# Altium schematic sheet tie-il0.SchDoc: Net Tie IL0
size 368 x 254 mm; CheckedBy: J. Brinton; CompanyName: Signal Laboratories, Inc.; DrawnBy: J. Brinton; Engineer: J. Brinton; Address1: 3479 Edison Way; Address2: Menlo Park CA 94025; Address3: +1 (877) 778-8435; Address4: siglabs.com; Revision: 3; SheetNumber: 41; SheetTotal: 45
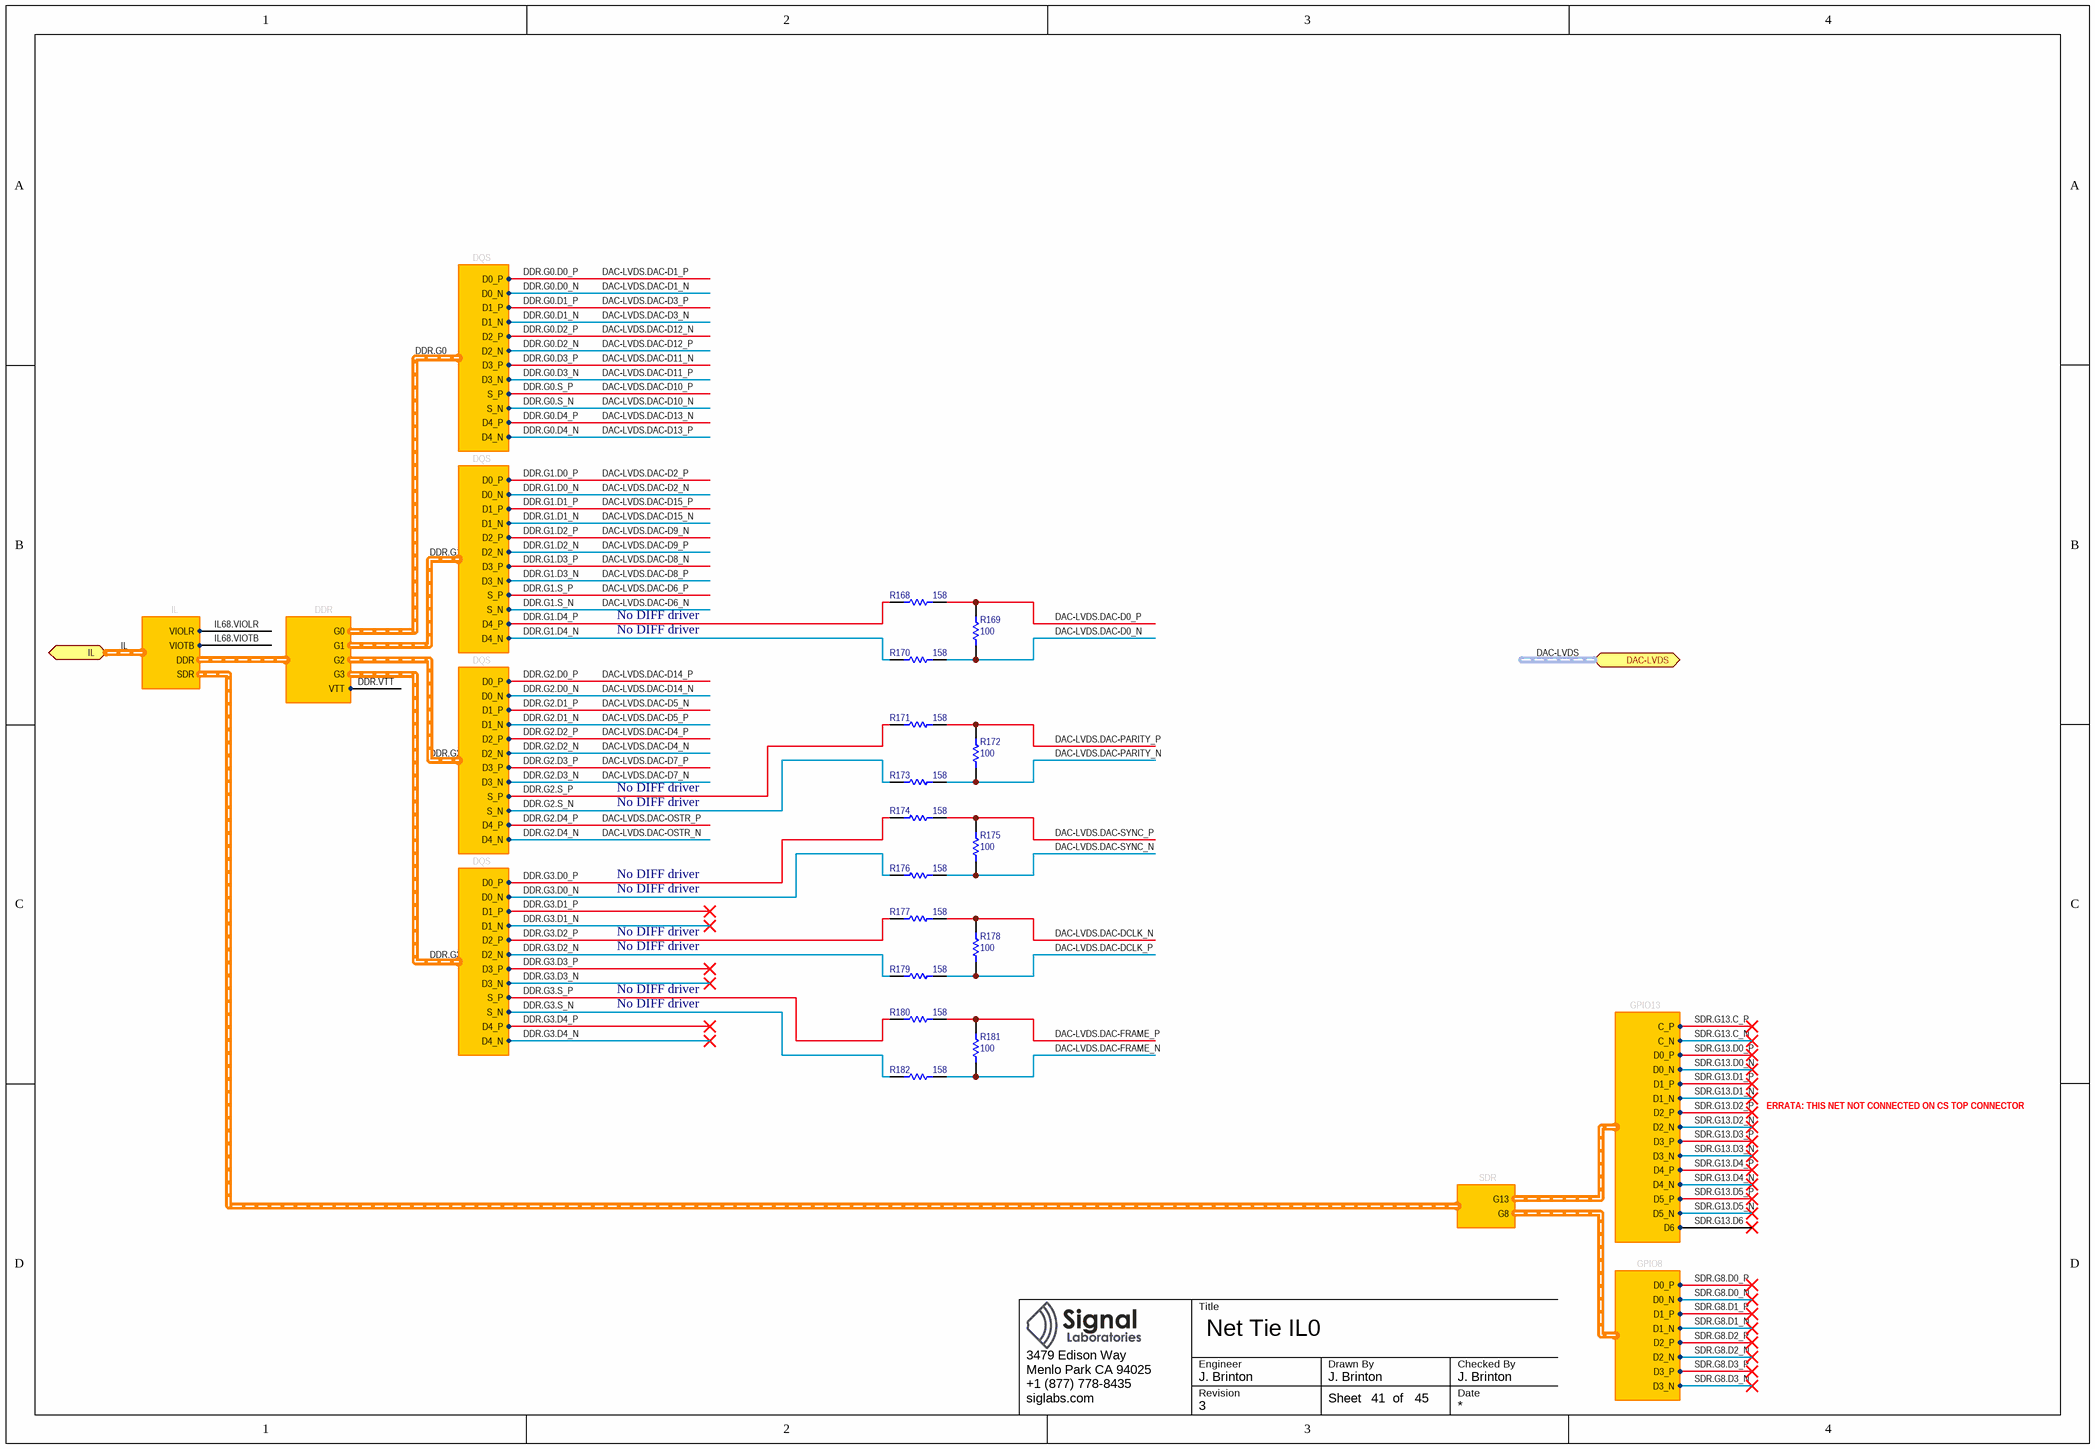
[diagram p0: tie-il0.SchDoc]

## Parts
R168  value 158  [RESC1005X40N]  (hidden comment: ERJ-2RKF1580X)
R169  value 100  [RESC1005X40N]  (hidden comment: ERJ-PA2F1000X)
R170  value 158  [RESC1005X40N]  (hidden comment: ERJ-2RKF1580X)
R171  value 158  [RESC1005X40N]  (hidden comment: ERJ-2RKF1580X)
R172  value 100  [RESC1005X40N]  (hidden comment: ERJ-PA2F1000X)
R173  value 158  [RESC1005X40N]  (hidden comment: ERJ-2RKF1580X)
R174  value 158  [RESC1005X40N]  (hidden comment: ERJ-2RKF1580X)
R175  value 100  [RESC1005X40N]  (hidden comment: ERJ-PA2F1000X)
R176  value 158  [RESC1005X40N]  (hidden comment: ERJ-2RKF1580X)
R177  value 158  [RESC1005X40N]  (hidden comment: ERJ-2RKF1580X)
R178  value 100  [RESC1005X40N]  (hidden comment: ERJ-PA2F1000X)
R179  value 158  [RESC1005X40N]  (hidden comment: ERJ-2RKF1580X)
R180  value 158  [RESC1005X40N]  (hidden comment: ERJ-2RKF1580X)
R181  value 100  [RESC1005X40N]  (hidden comment: ERJ-PA2F1000X)
R182  value 158  [RESC1005X40N]  (hidden comment: ERJ-2RKF1580X)

## Ports
DAC-LVDS (harness DAC-LVDS), IL (harness IL)

## Harnesses
DQS: D0_P, D0_N, D1_P, D1_N, D2_P, D2_N, D3_P, D3_N, D4_P, D4_N, S_P, S_N
DDR: G0, G1, G2, G3, VTT
GPIO8: D0_P, D0_N, D1_P, D1_N, D2_P, D2_N, D3_P, D3_N
SDR: G13, G8
GPIO13: C_P, C_N, D0_P, D0_N, D1_P, D1_N, D2_P, D2_N, D3_P, D3_N, D4_P, D4_N, D5_P, D5_N, D6
IL: DDR, SDR, VIOLR, VIOTB

## Nets
DAC-LVDS.DAC-D0_N: R169.2 R170.1
DAC-LVDS.DAC-D0_P: R168.1 R169.1
DAC-LVDS.DAC-D1_N: harness DQS.D0_N  [also labelled DDR.G0.D0_N]
DAC-LVDS.DAC-D1_P: harness DQS.D0_P  [also labelled DDR.G0.D0_P]
DAC-LVDS.DAC-D2_N: harness DQS.D0_N  [also labelled DDR.G1.D0_N]
DAC-LVDS.DAC-D2_P: harness DQS.D0_P  [also labelled DDR.G1.D0_P]
DAC-LVDS.DAC-D3_N: harness DQS.D1_N  [also labelled DDR.G0.D1_N]
DAC-LVDS.DAC-D3_P: harness DQS.D1_P  [also labelled DDR.G0.D1_P]
DAC-LVDS.DAC-D4_N: harness DQS.D2_N  [also labelled DDR.G2.D2_N]
DAC-LVDS.DAC-D4_P: harness DQS.D2_P  [also labelled DDR.G2.D2_P]
DAC-LVDS.DAC-D5_N: harness DQS.D1_P  [also labelled DDR.G2.D1_P]
DAC-LVDS.DAC-D5_P: harness DQS.D1_N  [also labelled DDR.G2.D1_N]
DAC-LVDS.DAC-D6_N: harness DQS.S_N  [also labelled DDR.G1.S_N]
DAC-LVDS.DAC-D6_P: harness DQS.S_P  [also labelled DDR.G1.S_P]
DAC-LVDS.DAC-D7_N: harness DQS.D3_N  [also labelled DDR.G2.D3_N]
DAC-LVDS.DAC-D7_P: harness DQS.D3_P  [also labelled DDR.G2.D3_P]
DAC-LVDS.DAC-D8_N: harness DQS.D3_P  [also labelled DDR.G1.D3_P]
DAC-LVDS.DAC-D8_P: harness DQS.D3_N  [also labelled DDR.G1.D3_N]
DAC-LVDS.DAC-D9_N: harness DQS.D2_P  [also labelled DDR.G1.D2_P]
DAC-LVDS.DAC-D9_P: harness DQS.D2_N  [also labelled DDR.G1.D2_N]
DAC-LVDS.DAC-D10_N: harness DQS.S_N  [also labelled DDR.G0.S_N]
DAC-LVDS.DAC-D10_P: harness DQS.S_P  [also labelled DDR.G0.S_P]
DAC-LVDS.DAC-D11_N: harness DQS.D3_P  [also labelled DDR.G0.D3_P]
DAC-LVDS.DAC-D11_P: harness DQS.D3_N  [also labelled DDR.G0.D3_N]
DAC-LVDS.DAC-D12_N: harness DQS.D2_P  [also labelled DDR.G0.D2_P]
DAC-LVDS.DAC-D12_P: harness DQS.D2_N  [also labelled DDR.G0.D2_N]
DAC-LVDS.DAC-D13_N: harness DQS.D4_P  [also labelled DDR.G0.D4_P]
DAC-LVDS.DAC-D13_P: harness DQS.D4_N  [also labelled DDR.G0.D4_N]
DAC-LVDS.DAC-D14_N: harness DQS.D0_N  [also labelled DDR.G2.D0_N]
DAC-LVDS.DAC-D14_P: harness DQS.D0_P  [also labelled DDR.G2.D0_P]
DAC-LVDS.DAC-D15_N: harness DQS.D1_N  [also labelled DDR.G1.D1_N]
DAC-LVDS.DAC-D15_P: harness DQS.D1_P  [also labelled DDR.G1.D1_P]
DAC-LVDS.DAC-DCLK_N: R177.1 R178.1
DAC-LVDS.DAC-DCLK_P: R178.2 R179.1
DAC-LVDS.DAC-FRAME_N: R181.2 R182.1
DAC-LVDS.DAC-FRAME_P: R180.1 R181.1
DAC-LVDS.DAC-OSTR_N: harness DQS.D4_N  [also labelled DDR.G2.D4_N]
DAC-LVDS.DAC-OSTR_P: harness DQS.D4_P  [also labelled DDR.G2.D4_P]
DAC-LVDS.DAC-PARITY_N: R172.2 R173.1
DAC-LVDS.DAC-PARITY_P: R171.1 R172.1
DAC-LVDS.DAC-SYNC_N: R175.2 R176.1
DAC-LVDS.DAC-SYNC_P: R174.1 R175.1
DDR.G1.D4_N: R170.2 ; harness DQS.D4_N
DDR.G1.D4_P: R168.2 ; harness DQS.D4_P
DDR.G2.S_N: R173.2 ; harness DQS.S_N
DDR.G2.S_P: R171.2 ; harness DQS.S_P
DDR.G3.D0_N: R176.2 ; harness DQS.D0_N
DDR.G3.D0_P: R174.2 ; harness DQS.D0_P
DDR.G3.D1_N: harness DQS.D1_N
DDR.G3.D1_P: harness DQS.D1_P
DDR.G3.D2_N: R179.2 ; harness DQS.D2_N
DDR.G3.D2_P: R177.2 ; harness DQS.D2_P
DDR.G3.D3_N: harness DQS.D3_N
DDR.G3.D3_P: harness DQS.D3_P
DDR.G3.D4_N: harness DQS.D4_N
DDR.G3.D4_P: harness DQS.D4_P
DDR.G3.S_N: R182.2 ; harness DQS.S_N
DDR.G3.S_P: R180.2 ; harness DQS.S_P
DDR.VTT: harness DDR.VTT
IL68.VIOLR: port IL.VIOLR  [project net IL.VIOLR]
IL68.VIOTB: port IL.VIOTB  [project net IL.VIOTB]
SDR.G8.D0_N: harness GPIO8.D0_N
SDR.G8.D0_P: harness GPIO8.D0_P
SDR.G8.D1_N: harness GPIO8.D1_N
SDR.G8.D1_P: harness GPIO8.D1_P
SDR.G8.D2_N: harness GPIO8.D2_N
SDR.G8.D2_P: harness GPIO8.D2_P
SDR.G8.D3_N: harness GPIO8.D3_N
SDR.G8.D3_P: harness GPIO8.D3_P
SDR.G13.C_N: harness GPIO13.C_N
SDR.G13.C_P: harness GPIO13.C_P
SDR.G13.D0_N: harness GPIO13.D0_N
SDR.G13.D0_P: harness GPIO13.D0_P
SDR.G13.D1_N: harness GPIO13.D1_N
SDR.G13.D1_P: harness GPIO13.D1_P
SDR.G13.D2_N: harness GPIO13.D2_N
SDR.G13.D2_P: harness GPIO13.D2_P
SDR.G13.D3_N: harness GPIO13.D3_N
SDR.G13.D3_P: harness GPIO13.D3_P
SDR.G13.D4_N: harness GPIO13.D4_N
SDR.G13.D4_P: harness GPIO13.D4_P
SDR.G13.D5_N: harness GPIO13.D5_N
SDR.G13.D5_P: harness GPIO13.D5_P
SDR.G13.D6: harness GPIO13.D6

## Buses and harness runs
harness DAC-LVDS = port DAC-LVDS
harness IL = port IL

## Notes on the sheet
- No DIFF driver
- ERRATA: THIS NET NOT CONNECTED ON CS TOP CONNECTOR
- Title
- Engineer
- Revision
- Drawn By
- Checked By
- Date
- Sheet
- of

## Library data of the parts
R168 R170 R171 R173 R174 R176 R177 R179 R180 R182 = RES 0402: Thick Film 158 ±1% 0402; Manufacturer: Panasonic; Tr: -55:155; Package: 0402; Manufacturer P/N: ERJ-2RKF1580X; Tolerance: ±1%
R169 R172 R175 R178 R181 = RES 0402: Thick Film 100 ±1% 0402; Manufacturer: Panasonic; Tr: -55:155; Package: 0402; Manufacturer P/N: ERJ-PA2F1000X; Tolerance: ±1%